# EasyEDA Pro project AC Power Switch.eprj, board PCB5
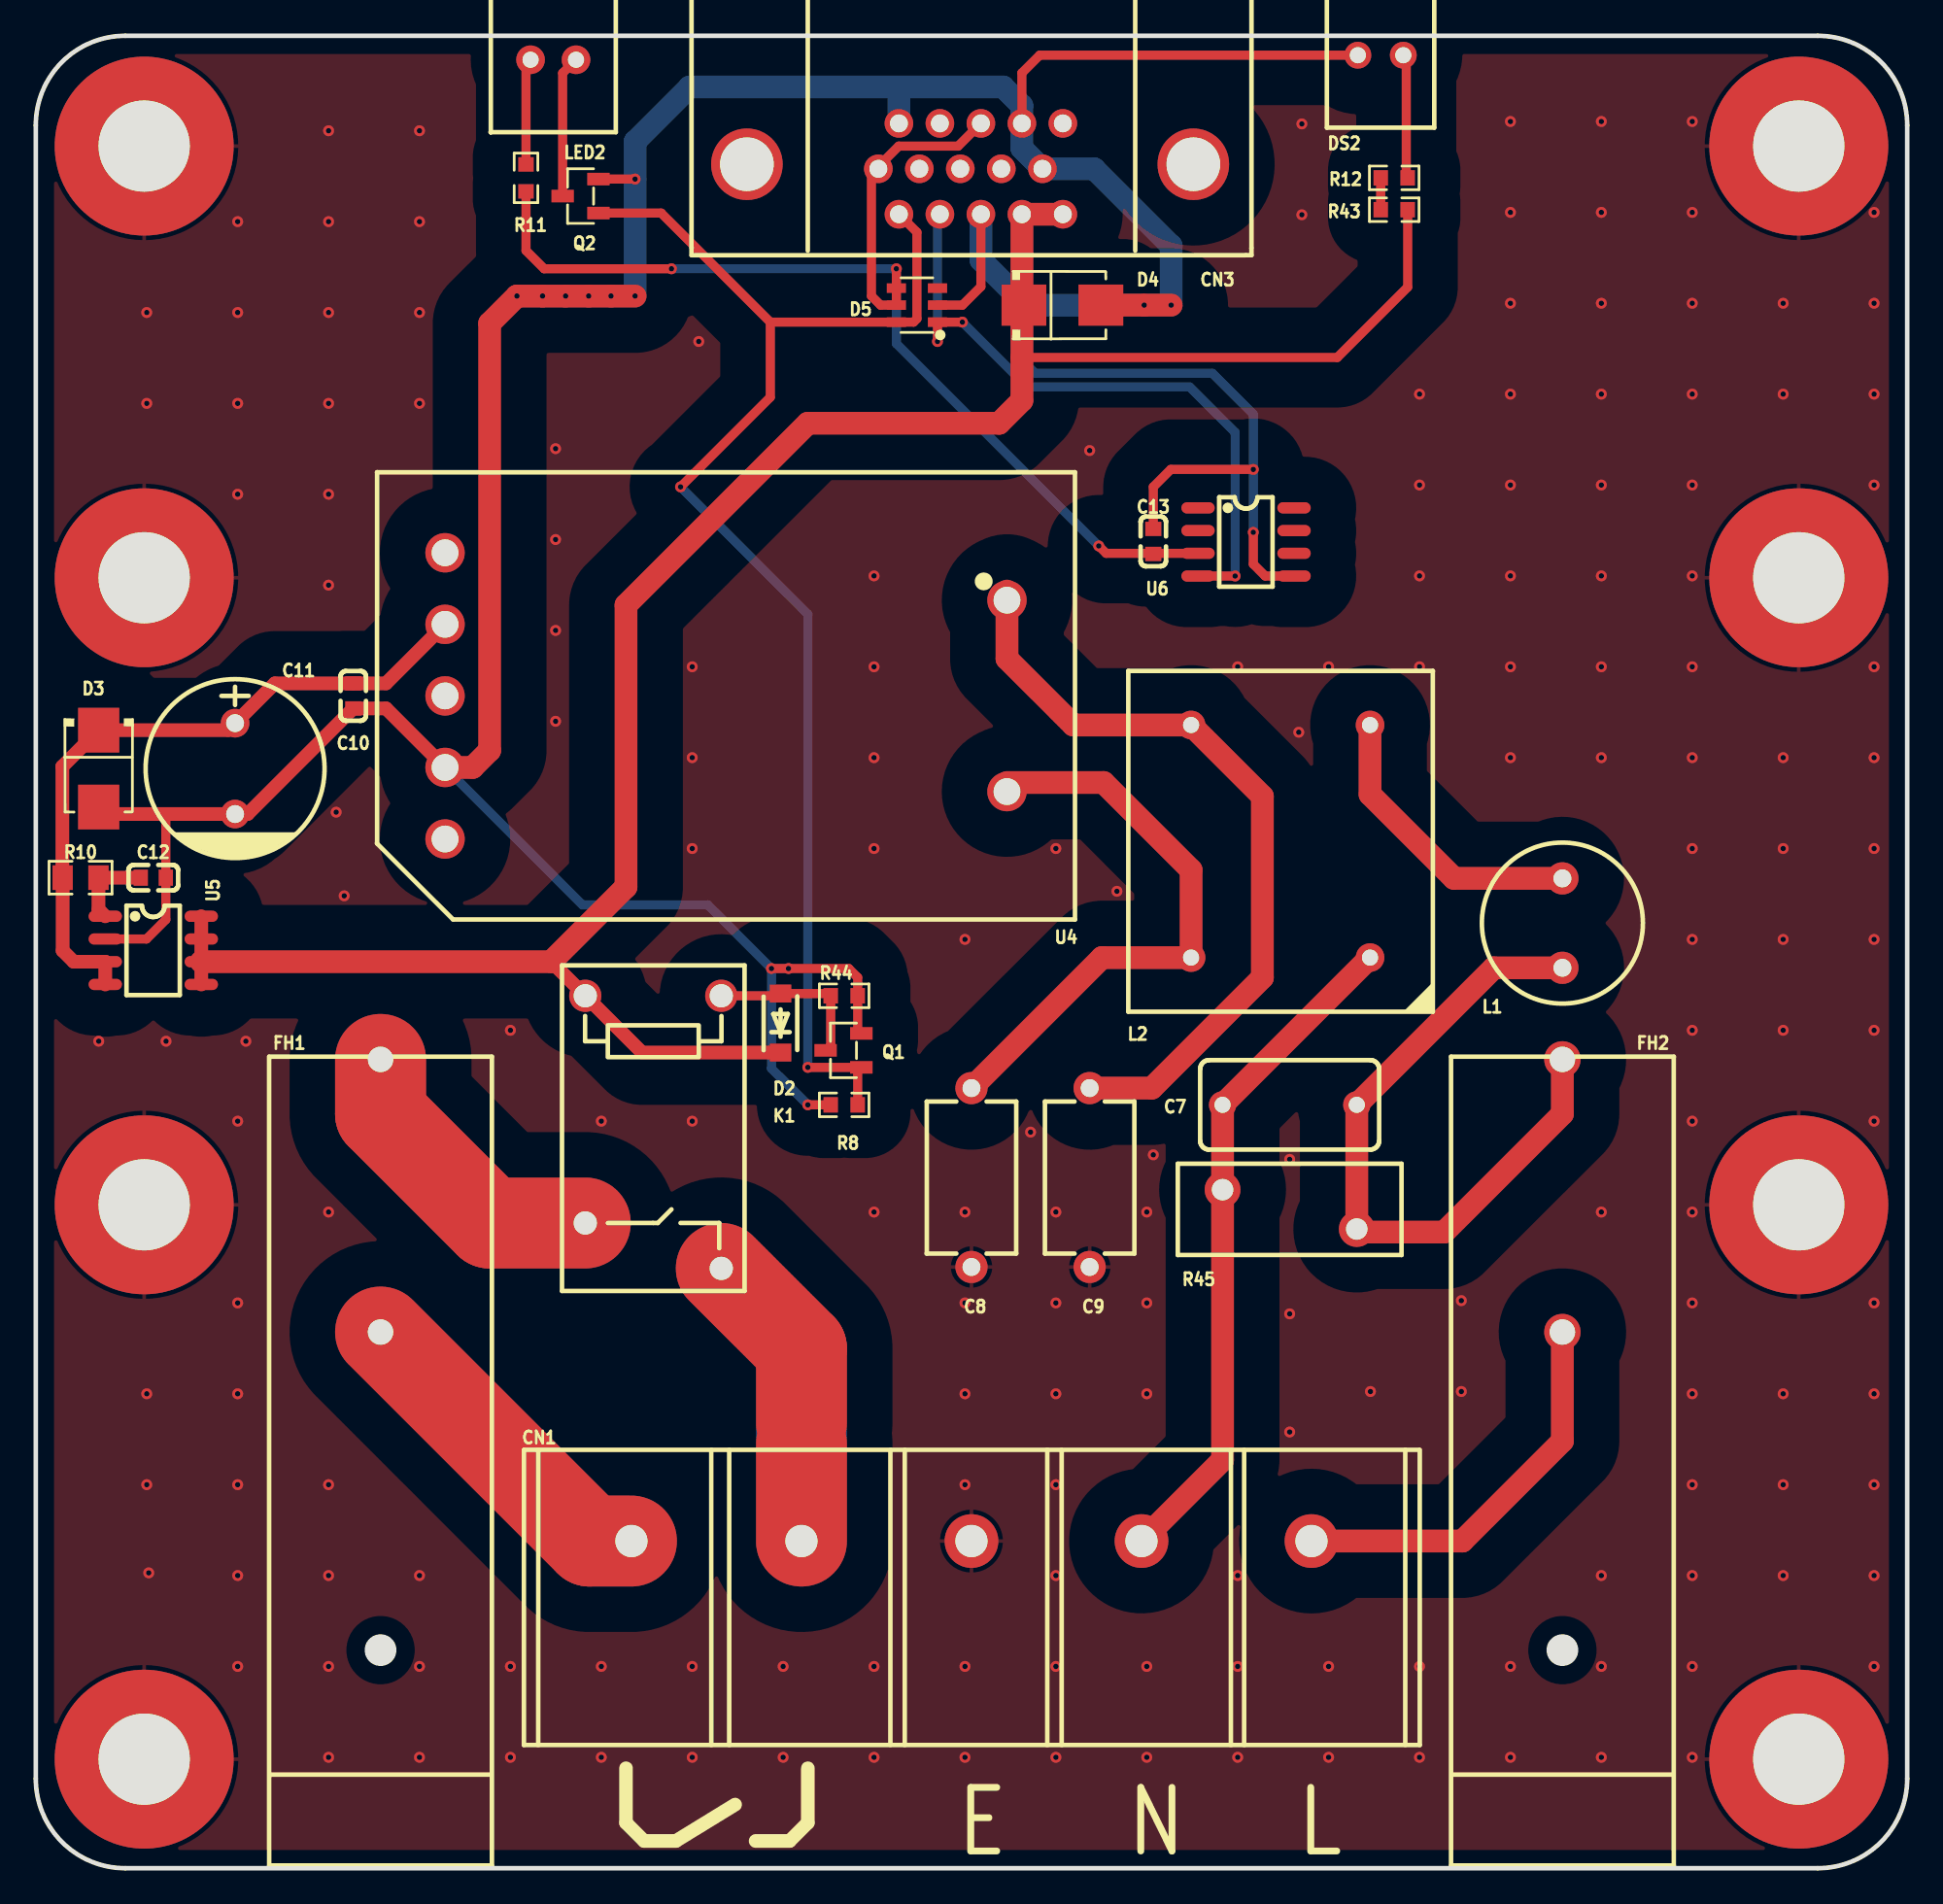
[diagram p11: board, top side]
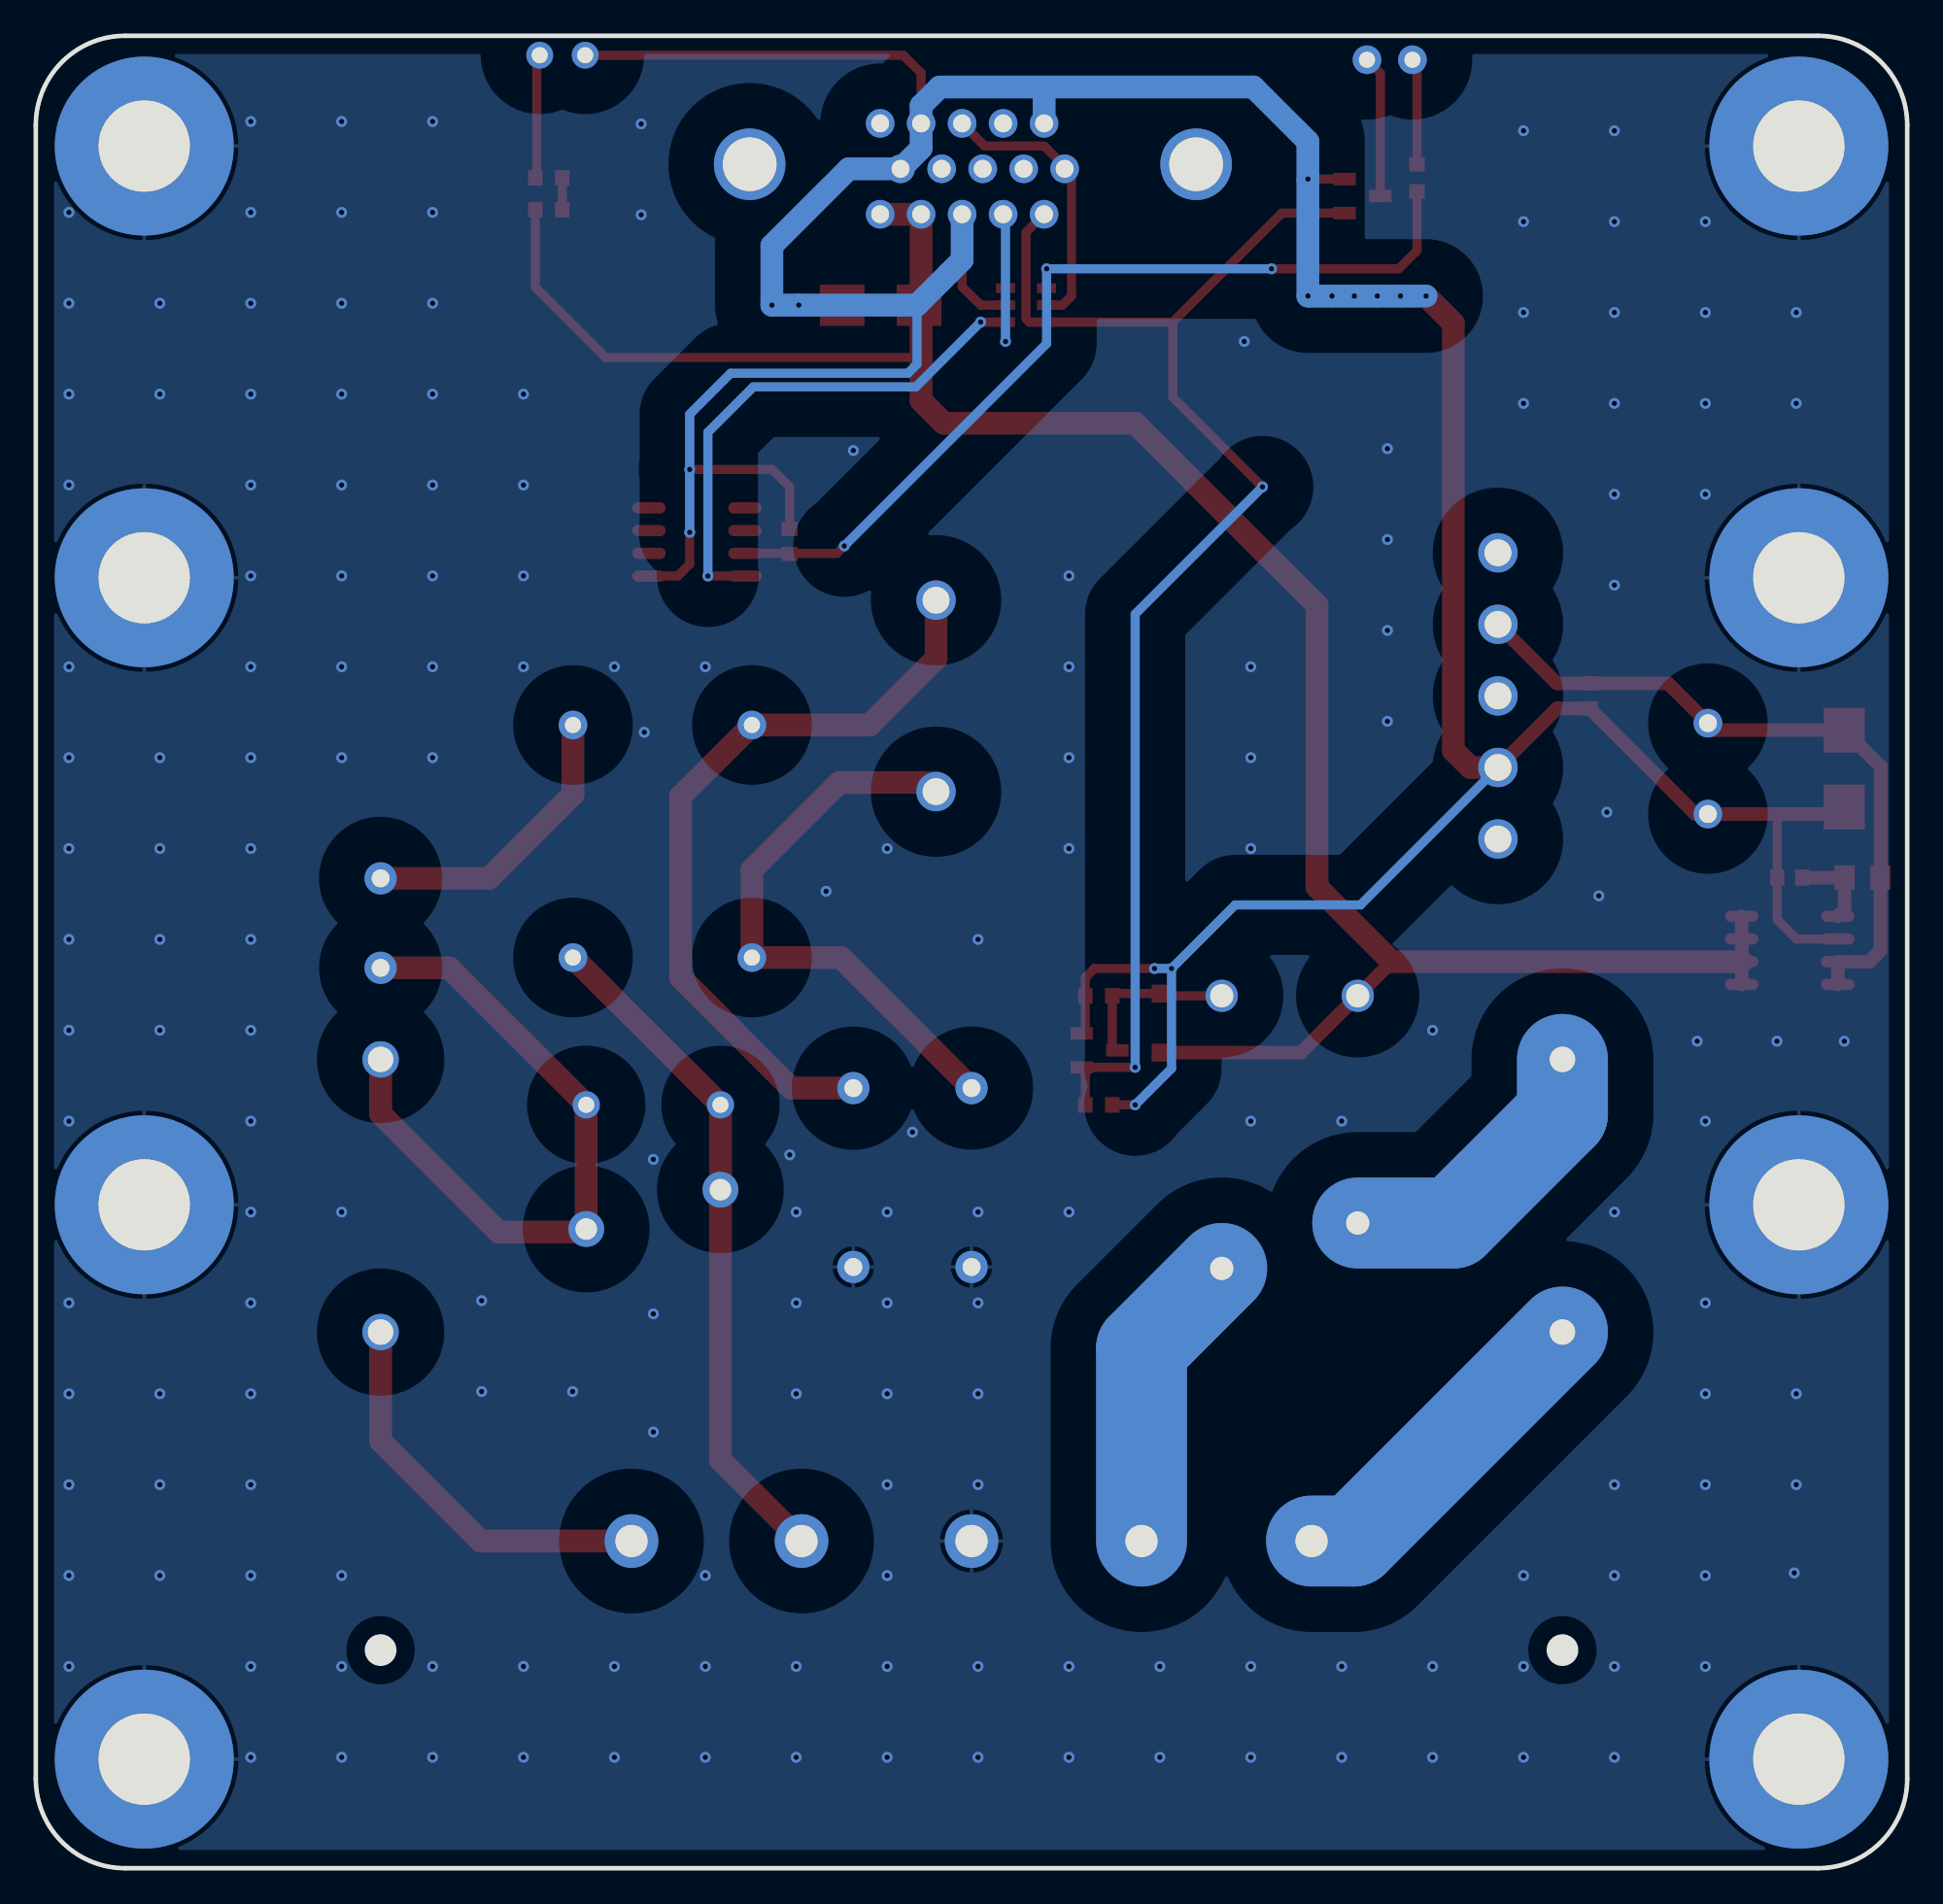
[diagram p12: board, bottom side, seen from below]

Outline 104.57 x 102.43 mm; copper layers: Top Layer, Bottom Layer. Coordinates in mm from the lower left corner of the outline.
Outline path: 0,97.43 0,5 arc(1.46,1.46) 5,0 99.57,0 arc(103.11,1.46) 104.57,5 104.57,97.43 arc(103.11,100.97) 99.57,102.43 5,102.43 arc(1.46,100.97) 0,97.43
Stack: Top Layer 0.035mm / Dielectric1 1.51mm FR4 er 4.5 / Bottom Layer 0.035mm

## Design rules (mm)
template: Custom Config
spacing copperThickness1oz (default): track to track 0.102, other pairs 0.152 to 0.3
spacing copperThickness2oz: track to track 0.203, other pairs 0.152 to 0.3
track width copperThickness1oz (default): min 0.127, default 0.254, max 7.62
track width copperThickness2oz: min 0.203, default 0.254, max 2.54
differential pair differentialPair (default): width min 0.127, default 0.254, max 2.54; gap min 0.152, default 0.152
via viaSize (default): diameter min 0.5, default 0.61, max 10; hole min 0.3, default 0.305, max 6.3

## Placement (name value [footprint] x y rotation side)
C7  100nF  [CAP-TH_L10.0-W5.0-P7.50-D0.6]  70.06 42.67 180 top
C8  1nF  [CAP-TH_L8.5-W5.0-P10.00-D0.6]  52.28 38.61 90 top
C9  1nF  [CAP-TH_L8.5-W5.0-P10.00-D0.6]  58.89 38.61 270 top
C10  1uF  [C0603]  17.74 65.53 90 top
C11  470uF  [CAP-TH_BD10.0-P5.00-D1.0-FD]  11.14 61.47 270 top
C12  100nF  [C0603]  6.56 55.37 180 top
C13  100nF  [C0603]  62.44 74.17 270 top
CN1  DBT50G-9.5-5P-BK-P OGC  [CONN-TH_5P-P9.50_DBT50G-9.5-5P]  52.28 18.29 0 top
CN3  DS1038-15FBNSiA74-0CC  [DSUB-TH_DS1038-15FBNSIA74-0CC]  52.21 95 180 top
D2  SM4007PL  [SOD-123F_L2.8-W1.8-LS3.7-RD]  41.62 47.24 90 top
D3  SMBJ15A  [SMB_L4.3-W3.6-LS5.3-RD]  3.52 61.47 270 top
D4  SMBJ15A  [SMB_L4.3-W3.6-LS5.3-RD]  57.36 87.38 0 top
D5  SRV05-4A  [SOT-23-6_L2.9-W1.6-P0.95-LS2.9-BL]  49.24 87.38 90 top
DS2  MHK1560UGBTD  [LED-TH_MHK1560UGBTD]  75.14 101.35 180 top
FH1  -  [03450101H]  19.26 37.59 90 top
FH2  -  [03450101H]  85.3 37.59 90 top
K1  JZC-11FH 012-1H1L  [RELAY-TH_QLRELAY_JZC-11FH-XXX-1H1L]  34.5 41.15 270 top
L1  470uH  [IND-TH_BD9.0-P5.00-D0.7]  85.3 52.83 90 top
L2  YDUU10.5-253L0321  [IND-TH_4P-L19.0-W17.0]  69.56 57.4 90 top
LED2  MHK1560CRBTD  [LED-TH_L12.2-W6.0-P2.54]  28.92 101.09 180 top
NOREF  -  [Pad_e295]  98.51 72.14 0 top
NOREF#2  -  [Pad_e253]  6.06 37.08 0 top
NOREF#3  -  [Pad_e54]  6.06 96.27 0 top
NOREF#4  -  [Pad_e294]  6.06 72.14 0 top
NOREF#5  -  [Pad_e52]  98.51 6.1 0 top
NOREF#6  -  [Pad_e50]  6.06 6.1 0 top
NOREF#7  -  [Pad_e252]  98.51 37.08 0 top
NOREF#8  -  [Pad_e53]  98.51 96.27 0 top
Q1  AO3400A  [SOT-23-3_L2.9-W1.3-P1.90-LS2.4-BR]  45.13 45.72 0 top
Q2  AO3400A  [SOT-23-3_L2.9-W1.3-P1.90-LS2.4-BR]  30.44 93.47 0 top
R8  10kΩ  [R0603]  45.17 42.67 0 top
R10  390Ω  [R0805]  2.5 55.37 180 top
R11  1kΩ  [R0603]  27.39 94.49 270 top
R12  1kΩ  [R0603]  75.91 94.49 0 top
R43  1kΩ  [R0603]  75.91 92.71 180 top
R44  10kΩ  [R0603]  45.17 48.77 0 top
R45  210pF@1kHz  [RES-TH_L12.5-W5.1-P7.50-D1.2-S2.20]  70.06 36.83 180 top
U4  TAS20-12-W2  [PWRM-TH_4P-L39.0-W25.0_TAS12-15-W2]  38.57 65.53 180 top
U5  MX5052S  [SOP-8_L4.9-W3.9-P1.27-LS6.0-BL]  6.56 51.31 270 top
U6  DS18B20Z(UMW)  [SOP-8_L4.9-W3.9-P1.27-LS6.0-BL]  67.63 74.14 270 top

## Footprints (pads in the part's own frame, mm; a bottom-side part is the same pattern mirrored in y, then rotated)
03450101H
  round 2.032 hole 1.423: 1(7.62,0) 2(-7.62,0)
C0603
  rect 0.8x0.9 smd: 1(-0.7,0) 2(0.7,0)
CAP-TH_BD10.0-P5.00-D1.0-FD
  round 1.6 hole 1: 1(-2.54,0) 2(2.54,0)
CAP-TH_L8.5-W5.0-P10.00-D0.6
  round 1.8 hole 1: 1(-5,0) 2(5,0)
CAP-TH_L10.0-W5.0-P7.50-D0.6
  round 1.524 hole 0.9: 1(-3.75,0) 2(3.75,0)
CONN-TH_5P-P9.50_DBT50G-9.5-5P
  round 3 hole 1.8: 1(-19,0) 2(-9.5,0) 3(0,0) 4(9.5,0) 5(19,0)
DSUB-TH_DS1038-15FBNSIA74-0CC
  round 1.6 hole 1: 1(3.978,2.54) 2(1.688,2.54) 3(-0.603,2.54) 4(-2.893,2.54) 5(-5.182,2.54) 6(5.128,0) 7(2.837,0) 8(0.548,0) 9(-1.743,0) 10(-4.042,0) 11(3.978,-2.54) 12(1.688,-2.54) 13(-0.603,-2.54) 14(-2.893,-2.54) 15(-5.182,-2.54)
  round 4 hole 3: 16(12.473,-0.254) 17(-12.473,-0.254)
IND-TH_4P-L19.0-W17.0
  round 1.6 hole 0.9: 1(-6.5,-5) 2(6.5,-5) 3(-6.5,5) 4(6.5,5)
IND-TH_BD9.0-P5.00-D0.7
  round 1.8 hole 1: 1(-2.5,0) 2(2.5,0)
LED-TH_L12.2-W6.0-P2.54
  round 1.6 hole 0.9: 1(-1.27,0) 2(1.27,0)
LED-TH_MHK1560UGBTD
  round 1.5 hole 0.9: 1(1.27,0) 2(-1.27,0)
Pad_e50
  round 10 hole 5.1: 1(0,0)
Pad_e52
  round 10 hole 5.1: 1(0,0)
Pad_e53
  round 10 hole 5.1: 1(0,0)
Pad_e54
  round 10 hole 5.1: 1(0,0)
Pad_e252
  round 10 hole 5.1: 1(0,0)
Pad_e253
  round 10 hole 5.1: 1(0,0)
Pad_e294
  round 10 hole 5.1: 1(0,0)
Pad_e295
  round 10 hole 5.1: 1(0,0)
PWRM-TH_4P-L39.0-W25.0_TAS12-15-W2
  round 2.2 hole 1.5: 1(-15.7,-5.35) 2(-15.7,5.35) 3(15.7,8) 4(15.7,4) 5(15.7,0) 6(15.7,-4) 7(15.7,-8)
R0603
  rect 0.806x0.864 smd: 1(-0.753,0) 2(0.753,0)
R0805
  rect 1.133x1.377 smd: 1(-1,0) 2(1,0)
RELAY-TH_QLRELAY_JZC-11FH-XXX-1H1L
  round 1.8 hole 1.3: 1(-7.62,-3.8) 2(-7.62,3.8) 3(7.62,3.8) 4(5.08,-3.8)
RES-TH_L12.5-W5.1-P7.50-D1.2-S2.20
  round 2 hole 1.2: 1(-3.749,1.1) 2(3.749,-1.1)
SMB_L4.3-W3.6-LS5.3-RD
  rect 2.5x2.3 smd: 1(-2.15,0) 2(2.15,0)
SOD-123F_L2.8-W1.8-LS3.7-RD
  rect 1x1.2 smd: 1(-1.65,0) 2(1.65,0)
SOP-8_L4.9-W3.9-P1.27-LS6.0-BL
  oval 0.63x1.865 smd: 1(-1.905,-2.683) 2(-0.635,-2.683) 3(0.635,-2.683) 4(1.905,-2.683) 5(1.905,2.683) 6(0.635,2.683) 7(-0.635,2.683) 8(-1.905,2.683)
SOT-23-3_L2.9-W1.3-P1.90-LS2.4-BR
  rect 1.25x0.7 smd: 1(1,-0.95) 2(1,0.95) 3(-1,0)
SOT-23-6_L2.9-W1.6-P0.95-LS2.9-BL
  rect 0.532x1.072 smd: 1(-0.95,-1.149) 2(0,-1.149) 3(0.95,-1.149) 4(0.95,1.149) 5(0,1.149) 6(-0.95,1.149)

## Nets
As in the schematic, except:
EARTH: C8.1 C9.2 CN1.3 NOREF.1 NOREF#2.1 NOREF#3.1 NOREF#4.1 NOREF#5.1 NOREF#6.1 NOREF#7.1 NOREF#8.1

Pads without a net: CN3 7 8 9 12 15 16 17; D5 3; U4 3 5 7; U6 1 2 6 7 8

## Via types
v1: diameter 0.61, hole 0.305, Top Layer to Bottom Layer, 197 vias

## Routing (per net, layer and track width the routed paths; a pad name or vN(x,y) marks a point on that pad's centre or on a via; arc(x,y) is an arc through that point)
+5V: length 68.4
  Top Layer w0.508: U6.3 59.81,73.5 v1(59.4,73.91) ; v1(48.09,89.41) D5.4 D5.5 47.2,87.38 46.7,87.88 46.7,94.61 CN3.6 ; v1(35.52,89.41) 28.41,89.41 27.39,90.42 R11.2 ; CN3.13 51.54,96.27 48.22,96.27 46.95,95 46.7,95
  Bottom Layer w0.508: v1(59.4,73.91) 48.09,85.22 v1(48.09,89.41) v1(35.52,89.41)
+12V: length 127
  Top Layer w0.508: R43.1 76.66,88.38 72.72,84.45 55.1,84.45
  Top Layer w0.762: 28.8,50.67 K1.1 33.88,45.59 D2.1 ; 9.25,53.21 U5.7 U5.6 U5.5
  Top Layer w1.27: U5.6 28.8,50.67 32.98,54.85 32.98,70.61 43.14,80.77 53.83,80.77 55.1,82.04 55.1,92.46 CN3.5
GND: length 252.9
  Top Layer w0.508: DS2.1 56.09,101.35 55.1,100.35 55.1,97.54 ; 7.26,58.9 C12.1 7.26,53.02 6.18,51.94 U5.2 ; v1(41.11,50.29) v1(42.06,50.29) 45.43,50.29 45.93,49.79 R44.2 45.93,46.87 Q1.2 ; R8.1 v1(43.14,42.67) ; U6.5 68.7,72.23 68.03,72.9 v1(68.03,74.68) ; D5.2 51.78,87.38 52.81,88.41 CN3.3 ; C13.1 62.44,77.22 63.42,78.19 v1(68.03,78.19) ; Q2.2 v1(33.49,94.42)
  Top Layer w0.762: 7.24,58.93 C11.2 11.84,58.93 C10.1 19.57,64.83 U4.4 ; 7.24,58.93 3.91,58.93 D3.2 ; 7.24,58.93 7.26,58.9
  Top Layer w1.27: D4.2 v1(61.94,87.38) v1(63.44,87.38) ; v1(33.49,87.88) v1(32.14,87.88) v1(30.89,87.88) v1(29.61,87.88) v1(28.32,87.88) v1(26.88,87.88) 25.36,86.36 25.36,62.48 24.41,61.53 U4.4
  Bottom Layer w0.508: v1(68.03,74.68) v1(68.03,78.19) 68.03,81.28 65.75,83.57 55.84,83.57 55.33,84.07 55.33,87.38 ; v1(41.11,50.29) 41.11,44.7 v1(43.14,42.67) ; v1(41.11,50.29) v1(42.06,50.29) ; v1(41.11,50.29) 37.55,53.85 30.55,53.85 U4.4 ; 53.54,89.14 53.54,89.17
  Bottom Layer w1.27: v1(26.88,87.88) v1(28.32,87.88) v1(29.61,87.88) v1(30.89,87.88) v1(32.14,87.88) v1(33.49,87.88) v1(33.49,94.42) 33.49,96.52 36.54,99.57 48.23,99.57 ; 48.23,99.57 54.06,99.57 55.1,98.53 55.1,96.14 CN3.10 59.14,95 63.44,90.7 v1(63.44,87.38) v1(61.94,87.38) 55.33,87.38 52.81,89.9 CN3.3 ; 48.23,99.57 CN3.11
ACCESS: length 78.5
  Top Layer w0.508: Q2.1 34.95,92.52 41.04,86.43 ; v1(43.14,44.77) Q1.1 45.93,44.56 R8.2 ; 41.04,86.43 41.04,82.23 v1(36.03,77.22) ; 41.04,86.43 D5.6 49.05,86.43 49.24,86.61 49.24,91.45 CN3.1
  Bottom Layer w0.508: v1(43.14,44.77) 43.14,70.1 v1(36.03,77.22)
EARTH: length 0.7
  Bottom Layer w2.032: NOREF.1 98.26,72.39 ; NOREF#3.1 5.8,96.52
  vias: v1(3.52,46.23) v1(6.2,86.96) v1(6.2,81.88) v1(6.2,26.52) v1(6.2,21.44) v1(6.31,16.51) v1(7.28,46.23) v1(11.28,92.04) v1(11.28,86.96) v1(11.28,81.88) v1(11.28,76.8) v1(11.28,41.76) v1(11.28,31.6) v1(11.28,26.52) v1(11.28,21.44) v1(11.28,16.36) v1(11.28,11.28) v1(11.74,46.23) v1(16.36,97.12) v1(16.36,92.04) v1(16.36,86.96) v1(16.36,81.88) v1(16.36,76.8) v1(16.36,71.72) v1(16.36,36.68) v1(16.36,21.44) v1(16.36,16.36) v1(16.36,11.28) v1(16.36,6.2) v1(16.78,59.03) v1(17.23,54.36) v1(21.44,97.12) v1(21.44,92.04) v1(21.44,86.96) v1(21.44,81.88) v1(21.44,16.36) v1(21.44,11.28) v1(21.44,6.2) v1(26.52,46.84) v1(26.52,11.28) v1(26.52,6.2) v1(29.05,79.35) v1(29.05,74.27) v1(29.05,69.19) v1(29.05,64.11) v1(31.6,41.76) v1(31.6,11.28) v1(31.6,6.2) v1(36.68,67.16) v1(36.68,62.08) v1(36.68,57) v1(36.68,41.76) v1(36.68,11.28) v1(36.68,6.2) v1(37.04,85.34) v1(41.76,11.28) v1(41.76,6.2) v1(46.84,72.24) v1(46.84,67.16) v1(46.84,62.08) v1(46.84,57) v1(46.84,36.68) v1(46.84,11.28) v1(46.84,6.2) v1(51.92,51.92) v1(51.92,36.68) v1(51.92,31.6) v1(51.92,26.52) v1(51.92,21.44) v1(51.92,11.28) v1(51.92,6.2) v1(55.59,41.15) v1(57,57) v1(57,36.68) v1(57,31.6) v1(57,26.52) v1(57,21.44) v1(57,16.36) v1(57,11.28) v1(57,6.2) v1(58.89,79.25) v1(60.41,54.61) v1(62.08,36.68) v1(62.08,31.6) v1(62.08,26.52) v1(62.08,11.28) v1(62.08,6.2) v1(62.44,39.88) v1(67.16,67.16) v1(67.16,16.36) v1(67.16,11.28) v1(67.16,6.2) v1(70.06,39.62) v1(70.06,30.99) v1(70.06,24.38) v1(70.57,63.5) v1(70.75,97.51) v1(70.75,92.43) v1(72.24,67.16) v1(72.24,11.28) v1(72.24,6.2) v1(74.58,26.65) v1(77.32,82.4) v1(77.32,77.32) v1(77.32,72.24) v1(77.32,67.16) v1(77.32,11.28) v1(77.32,6.2) v1(79.66,31.73) v1(79.66,26.65) v1(82.4,97.64) v1(82.4,92.56) v1(82.4,87.48) v1(82.4,82.4) v1(82.4,77.32) v1(82.4,72.24) v1(82.4,67.16) v1(82.4,62.08) v1(82.4,11.28) v1(82.4,6.2) v1(87.48,97.64) v1(87.48,92.56) v1(87.48,87.48) v1(87.48,82.4) v1(87.48,77.32) v1(87.48,72.24) v1(87.48,67.16) v1(87.48,62.08) v1(87.48,36.68) v1(87.48,16.36) v1(87.48,11.28) v1(87.48,6.2) v1(92.56,97.64) v1(92.56,92.56) v1(92.56,87.48) v1(92.56,82.4) v1(92.56,77.32) v1(92.56,72.24) v1(92.56,67.16) v1(92.56,62.08) v1(92.56,57) v1(92.56,51.92) v1(92.56,46.84) v1(92.56,41.76) v1(92.56,36.68) v1(92.56,31.6) v1(92.56,26.52) v1(92.56,21.44) v1(92.56,16.36) v1(92.56,11.28) v1(92.56,6.2) v1(97.64,87.48) v1(97.64,82.4) v1(97.64,62.08) v1(97.64,57) v1(97.64,51.92) v1(97.64,46.84) v1(97.64,26.52) v1(97.64,21.44) v1(97.64,16.36) v1(102.72,92.56) v1(102.72,87.48) v1(102.72,82.4) v1(102.72,77.32) v1(102.72,67.16) v1(102.72,62.08) v1(102.72,57) v1(102.72,51.92) v1(102.72,46.84) v1(102.72,41.76) v1(102.72,31.6) v1(102.72,26.52) v1(102.72,21.44) v1(102.72,16.36) v1(102.72,11.28)
LIVE: length 22.4
  Top Layer w1.27: FH2.2 85.3,23.88 79.72,18.29 CN1.5
NEUTRAL: length 37.9
  Top Layer w1.27: C7.2 74.56,50.91 ; 66.32,42.67 R45.2 66.32,22.82 CN1.4
ONEWIRE: length 37.5
  Top Layer w0.508: v1(50.39,85.34) D5.1 v1(51.78,86.43) ; U6.4 v1(67.02,72.23)
  Bottom Layer w0.508: CN3.2 50.39,92.32 v1(50.39,85.34) ; v1(67.02,72.23) 67.02,80.26 64.48,82.8 55.4,82.8 v1(51.78,86.43)
SWITCH1: length 37.7
  Top Layer w5.08: FH1.2 30.95,18.29 CN1.1
  Bottom Layer w5.08: FH1.2 30.95,18.29 CN1.1
SWITCH2: length 33
  Top Layer w5.08: 42.78,24.89 42.78,29.05 K1.3 ; 42.78,23.72 CN1.2
  Bottom Layer w5.08: K1.3 42.78,29.05 CN1.2
$1N1091: length 43.6
  Top Layer w1.27: C9.1 62.36,43.61 68.54,49.78 68.54,59.92 L2.4 57.98,63.9 54.27,67.61 54.27,71.39
$1N1092: length 32.5
  Top Layer w1.27: C8.2 59.58,50.9 L2.3 64.56,55.8 59.67,60.69 54.27,60.69
$1N1094: length 16.6
  Top Layer w1.27: L1.2 79.25,55.33 74.56,60.02 L2.2
$1N1096: length 39
  Top Layer w1.27: 73.81,35.56 C7.1 81.47,50.33 L1.1 ; 73.81,35.56 78.7,35.56 85.3,42.16 FH2.1
$1N1098: length 38.9
  Top Layer w0.762: U5.4 U5.3 2.12,50.67 1.5,51.29 R10.2 1.48,55.39 1.48,61.59 D3.1 10.75,63.62 C11.1 13.36,66.23 C10.2 19.57,66.23 U4.6
$1N1102: length 7
  Top Layer w0.508: DS2.2 76.58,101.18 76.58,94.46
$1N1103: length 1.8
  Top Layer w0.508: R43.2 75.15,94.38 75.07,94.46
$1N1104: length 4.7
  Top Layer w0.762: 3.88,53.21 3.5,53.59 R10.1 C12.2
$1N1155: length 34
  Top Layer w5.08: K1.4 25.36,36.07 19.26,42.16 FH1.1
  Bottom Layer w5.08: FH1.1 19.26,42.16 25.36,36.07 K1.4
$1N1301: length 9.4
  Top Layer w0.508: K1.2 41.49,48.77 D2.2 44.29,48.89 R44.1 44.42,45.98 44.15,45.72 Q1.3
$1N2019: length 6
  Top Layer w0.508: LED2.2 27.39,100.84 R11.1
$1N2020: length 7.9
  Top Layer w0.508: LED2.1 29.44,100.35 Q2.3

## Copper pours and planes (outline as drawn; the poured copper is in the pictures)
EARTH on Top Layer: -4.1,104.65 108.16,104.65 108.16,-3.05 -4.1,-3.05
EARTH on Bottom Layer: -5.63,106.17 106.64,106.17 106.64,-4.06 -5.63,-4.06

## Text on the board
Top Silkscreen Layer: E | N | L
